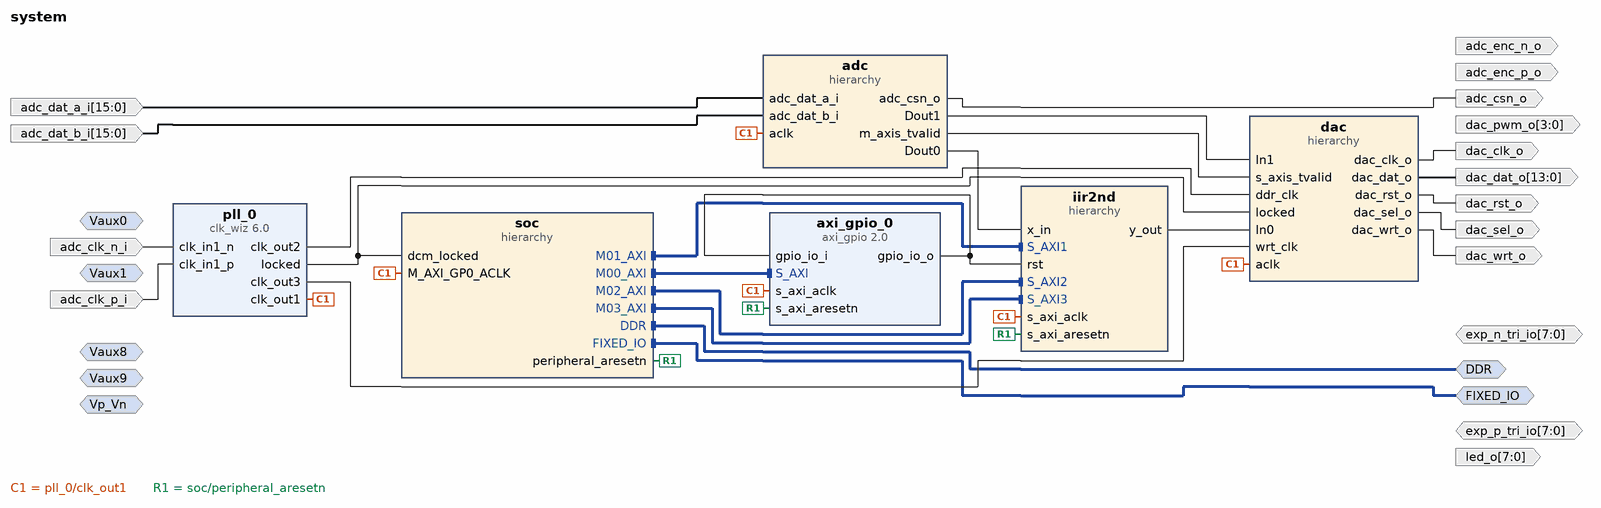
[diagram p0: block diagram of the top level]
# Vivado block design system, xc7z010clg400-1, Vivado 2024.1
create_bd_design system

create_bd_intf_port -mode Slave -vlnv xilinx.com:interface:diff_analog_io_rtl:1.0 Vp_Vn
create_bd_intf_port -mode Slave -vlnv xilinx.com:interface:diff_analog_io_rtl:1.0 Vaux0
create_bd_intf_port -mode Slave -vlnv xilinx.com:interface:diff_analog_io_rtl:1.0 Vaux1
create_bd_intf_port -mode Slave -vlnv xilinx.com:interface:diff_analog_io_rtl:1.0 Vaux9
create_bd_intf_port -mode Slave -vlnv xilinx.com:interface:diff_analog_io_rtl:1.0 Vaux8
create_bd_intf_port -mode Master -vlnv xilinx.com:interface:ddrx_rtl:1.0 DDR
create_bd_intf_port -mode Master -vlnv xilinx.com:display_processing_system7:fixedio_rtl:1.0 FIXED_IO
create_bd_port -dir I -from 15 -to 0 adc_dat_a_i
create_bd_port -dir I -from 15 -to 0 adc_dat_b_i
create_bd_port -dir I adc_clk_p_i
create_bd_port -dir I adc_clk_n_i
create_bd_port -dir O adc_enc_p_o
create_bd_port -dir O adc_enc_n_o
create_bd_port -dir O adc_csn_o
create_bd_port -dir O -from 13 -to 0 dac_dat_o
create_bd_port -dir O dac_clk_o
create_bd_port -dir O dac_rst_o
create_bd_port -dir O dac_sel_o
create_bd_port -dir O dac_wrt_o
create_bd_port -dir O -from 3 -to 0 dac_pwm_o
create_bd_port -dir IO -from 7 -to 0 exp_p_tri_io
create_bd_port -dir IO -from 7 -to 0 exp_n_tri_io
create_bd_port -dir O -from 7 -to 0 led_o

create_bd_cell -type ip -vlnv xilinx.com:ip:clk_wiz:6.0 pll_0
set_property -dict [list \
  CONFIG.CLKIN1_JITTER_PS 80.0 \
  CONFIG.CLKOUT1_DRIVES BUFG \
  CONFIG.CLKOUT1_JITTER 119.348 \
  CONFIG.CLKOUT1_PHASE_ERROR 96.948 \
  CONFIG.CLKOUT1_REQUESTED_OUT_FREQ 125.0 \
  CONFIG.CLKOUT1_USED true \
  CONFIG.CLKOUT2_DRIVES BUFG \
  CONFIG.CLKOUT2_JITTER 104.759 \
  CONFIG.CLKOUT2_PHASE_ERROR 96.948 \
  CONFIG.CLKOUT2_REQUESTED_OUT_FREQ 250.0 \
  CONFIG.CLKOUT2_REQUESTED_PHASE 157.5 \
  CONFIG.CLKOUT2_USED true \
  CONFIG.CLKOUT3_DRIVES BUFG \
  CONFIG.CLKOUT3_JITTER 104.759 \
  CONFIG.CLKOUT3_PHASE_ERROR 96.948 \
  CONFIG.CLKOUT3_REQUESTED_OUT_FREQ 250.0 \
  CONFIG.CLKOUT3_REQUESTED_PHASE 202.5 \
  CONFIG.CLKOUT3_USED true \
  CONFIG.CLKOUT4_DRIVES BUFG \
  CONFIG.CLKOUT4_JITTER 158.331 \
  CONFIG.CLKOUT4_PHASE_ERROR 96.948 \
  CONFIG.CLKOUT4_USED true \
  CONFIG.CLKOUT5_DRIVES BUFG \
  CONFIG.CLKOUT6_DRIVES BUFG \
  CONFIG.CLKOUT7_DRIVES BUFG \
  CONFIG.CLK_OUT1_PORT clk_out1 \
  CONFIG.CLK_OUT4_PORT clk_out4 \
  CONFIG.MMCM_CLKFBOUT_MULT_F 8 \
  CONFIG.MMCM_CLKIN1_PERIOD 8.000 \
  CONFIG.MMCM_CLKIN2_PERIOD 10.0 \
  CONFIG.MMCM_CLKOUT0_DIVIDE_F 8 \
  CONFIG.MMCM_CLKOUT1_DIVIDE 4 \
  CONFIG.MMCM_CLKOUT1_PHASE 157.500 \
  CONFIG.MMCM_CLKOUT2_DIVIDE 4 \
  CONFIG.MMCM_CLKOUT2_PHASE 202.500 \
  CONFIG.MMCM_CLKOUT3_DIVIDE 32 \
  CONFIG.NUM_OUT_CLKS 4 \
  CONFIG.PLL_CLKIN_PERIOD 8.000 \
  CONFIG.PRIMITIVE PLL \
  CONFIG.PRIM_IN_FREQ 125.0 \
  CONFIG.PRIM_SOURCE Differential_clock_capable_pin \
  CONFIG.SECONDARY_SOURCE Single_ended_clock_capable_pin \
  CONFIG.USE_PHASE_ALIGNMENT true \
  CONFIG.USE_RESET false \
] [get_bd_cells pll_0]
create_bd_cell -type hier soc
create_bd_cell -type hier iir2nd
create_bd_cell -type hier dac
create_bd_cell -type hier adc
create_bd_cell -type ip -vlnv xilinx.com:ip:axi_gpio:2.0 axi_gpio_0
set_property -dict [list \
  CONFIG.C_ALL_INPUTS 0 \
  CONFIG.C_ALL_OUTPUTS 0 \
  CONFIG.C_GPIO_WIDTH 1 \
  CONFIG.C_IS_DUAL 0 \
] [get_bd_cells axi_gpio_0]

# ---- hierarchy /soc ----
current_bd_instance /soc
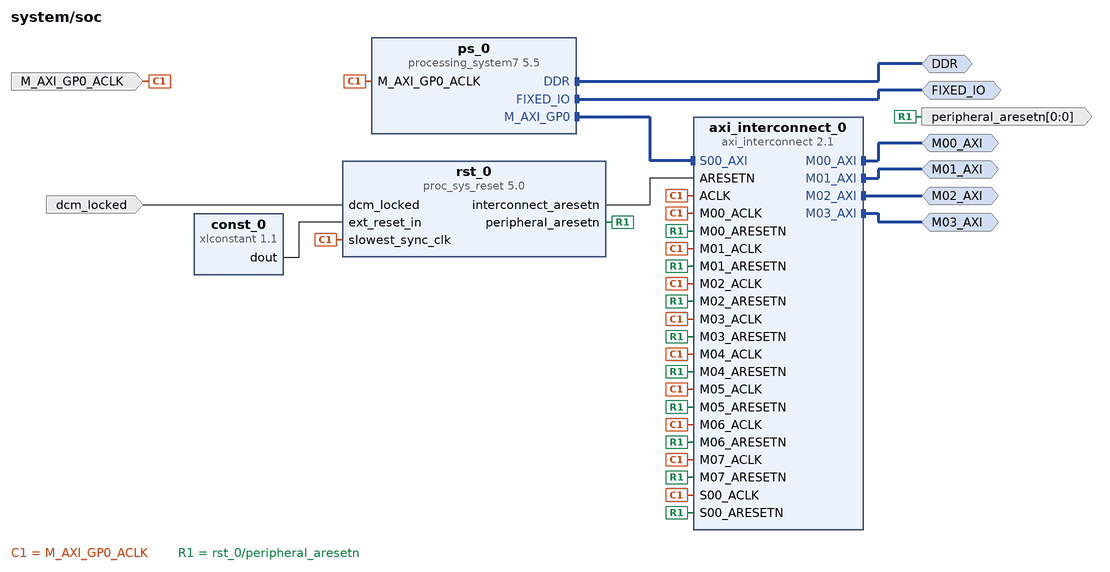
[diagram p1: block diagram inside /soc]
create_bd_intf_pin -mode Master -vlnv xilinx.com:interface:ddrx_rtl:1.0 DDR
create_bd_intf_pin -mode Master -vlnv xilinx.com:display_processing_system7:fixedio_rtl:1.0 FIXED_IO
create_bd_intf_pin -mode Master -vlnv xilinx.com:interface:aximm_rtl:1.0 M00_AXI
create_bd_intf_pin -mode Master -vlnv xilinx.com:interface:aximm_rtl:1.0 M01_AXI
create_bd_intf_pin -mode Master -vlnv xilinx.com:interface:aximm_rtl:1.0 M02_AXI
create_bd_intf_pin -mode Master -vlnv xilinx.com:interface:aximm_rtl:1.0 M03_AXI
create_bd_pin -dir I -type clk M_AXI_GP0_ACLK
create_bd_pin -dir I dcm_locked
create_bd_pin -dir O -from 0 -to 0 -type rst peripheral_aresetn

create_bd_cell -type ip -vlnv xilinx.com:ip:processing_system7:5.5 ps_0
set_property -dict [list \
  CONFIG.PCW_APU_PERIPHERAL_FREQMHZ 666.666666 \
  CONFIG.PCW_ENET0_ENET0_IO {MIO 16 .. 27} \
  CONFIG.PCW_ENET0_GRP_MDIO_ENABLE 1 \
  CONFIG.PCW_ENET0_GRP_MDIO_IO {MIO 52 .. 53} \
  CONFIG.PCW_ENET0_PERIPHERAL_ENABLE 1 \
  CONFIG.PCW_ENET0_RESET_ENABLE 0 \
  CONFIG.PCW_ENET_RESET_ENABLE 1 \
  CONFIG.PCW_ENET_RESET_SELECT {Share reset pin} \
  CONFIG.PCW_FPGA0_PERIPHERAL_FREQMHZ 50 \
  CONFIG.PCW_FPGA1_PERIPHERAL_FREQMHZ 50 \
  CONFIG.PCW_GPIO_EMIO_GPIO_ENABLE 1 \
  CONFIG.PCW_GPIO_EMIO_GPIO_IO 64 \
  CONFIG.PCW_GPIO_MIO_GPIO_ENABLE 1 \
  CONFIG.PCW_GPIO_MIO_GPIO_IO MIO \
  CONFIG.PCW_GPIO_PERIPHERAL_ENABLE 1 \
  CONFIG.PCW_I2C0_GRP_INT_ENABLE 0 \
  CONFIG.PCW_I2C0_I2C0_IO {MIO 50 .. 51} \
  CONFIG.PCW_I2C0_PERIPHERAL_ENABLE 1 \
  CONFIG.PCW_I2C_PERIPHERAL_FREQMHZ 111.111115 \
  CONFIG.PCW_I2C_RESET_ENABLE 1 \
  CONFIG.PCW_I2C_RESET_SELECT {Share reset pin} \
  CONFIG.PCW_IMPORT_BOARD_PRESET cfg/red_pitaya.xml \
  CONFIG.PCW_PRESET_BANK1_VOLTAGE {LVCMOS 2.5V} \
  CONFIG.PCW_QSPI_PERIPHERAL_ENABLE 0 \
  CONFIG.PCW_SD0_GRP_CD_ENABLE 1 \
  CONFIG.PCW_SD0_GRP_CD_IO {MIO 46} \
  CONFIG.PCW_SD0_GRP_WP_ENABLE 1 \
  CONFIG.PCW_SD0_GRP_WP_IO {MIO 47} \
  CONFIG.PCW_SD0_PERIPHERAL_ENABLE 1 \
  CONFIG.PCW_SD0_SD0_IO {MIO 40 .. 45} \
  CONFIG.PCW_SDIO_PERIPHERAL_FREQMHZ 100 \
  CONFIG.PCW_SPI0_PERIPHERAL_ENABLE 1 \
  CONFIG.PCW_SPI0_SPI0_IO EMIO \
  CONFIG.PCW_SPI1_PERIPHERAL_ENABLE 1 \
  CONFIG.PCW_SPI1_SPI1_IO {MIO 10 .. 15} \
  CONFIG.PCW_UART0_PERIPHERAL_ENABLE 1 \
  CONFIG.PCW_UART0_UART0_IO {MIO 14 .. 15} \
  CONFIG.PCW_UART1_PERIPHERAL_ENABLE 1 \
  CONFIG.PCW_UART1_UART1_IO {MIO 8 .. 9} \
  CONFIG.PCW_UART_PERIPHERAL_FREQMHZ 100 \
  CONFIG.PCW_UIPARAM_DDR_BUS_WIDTH {16 Bit} \
  CONFIG.PCW_UIPARAM_DDR_FREQ_MHZ 533.333333 \
  CONFIG.PCW_UIPARAM_DDR_PARTNO {MT41J256M16 RE-125} \
  CONFIG.PCW_USB0_PERIPHERAL_ENABLE 1 \
  CONFIG.PCW_USB0_RESET_ENABLE 1 \
  CONFIG.PCW_USB0_RESET_IO {MIO 48} \
  CONFIG.PCW_USB0_USB0_IO {MIO 28 .. 39} \
  CONFIG.PCW_USB_RESET_ENABLE 1 \
  CONFIG.PCW_USB_RESET_SELECT {Share reset pin} \
] [get_bd_cells ps_0]
# 429 more settings of ps_0 are not shown: defaults, MIO pin electricals, DDR timing, and values the tool derives
create_bd_cell -type ip -vlnv xilinx.com:ip:proc_sys_reset:5.0 rst_0
create_bd_cell -type ip -vlnv xilinx.com:ip:axi_interconnect:2.1 axi_interconnect_0
set_property -dict {CONFIG.NUM_MI 8} [get_bd_cells axi_interconnect_0]
create_bd_cell -type ip -vlnv xilinx.com:ip:xlconstant:1.1 const_0

# ---- hierarchy /iir2nd ----
current_bd_instance /iir2nd
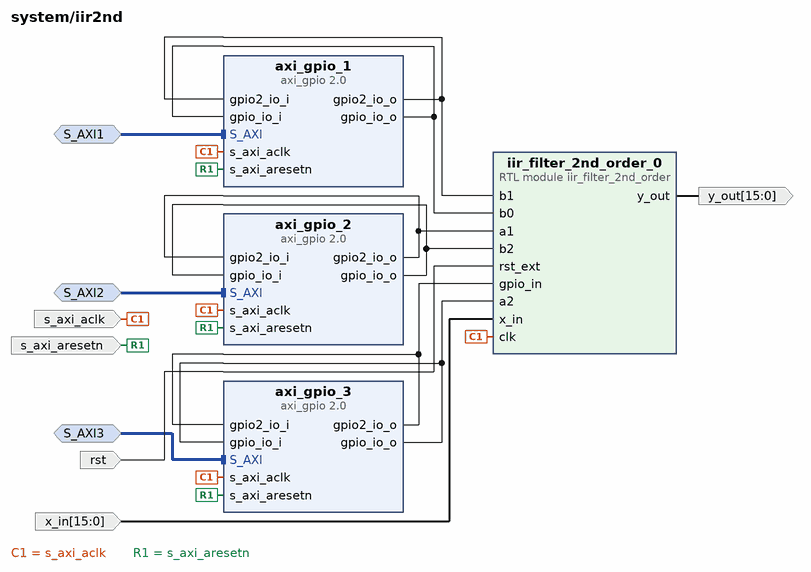
[diagram p2: block diagram inside /iir2nd]
create_bd_intf_pin -mode Slave -vlnv xilinx.com:interface:aximm_rtl:1.0 S_AXI1
create_bd_intf_pin -mode Slave -vlnv xilinx.com:interface:aximm_rtl:1.0 S_AXI2
create_bd_intf_pin -mode Slave -vlnv xilinx.com:interface:aximm_rtl:1.0 S_AXI3
create_bd_pin -dir I -type rst s_axi_aresetn
create_bd_pin -dir I -type clk s_axi_aclk
create_bd_pin -dir I -from 15 -to 0 x_in
create_bd_pin -dir O -from 15 -to 0 y_out
create_bd_pin -dir I -type rst rst

create_bd_cell -type ip -vlnv xilinx.com:ip:axi_gpio:2.0 axi_gpio_1
set_property -dict {CONFIG.C_IS_DUAL 1} [get_bd_cells axi_gpio_1]
create_bd_cell -type ip -vlnv xilinx.com:ip:axi_gpio:2.0 axi_gpio_2
set_property -dict {CONFIG.C_IS_DUAL 1} [get_bd_cells axi_gpio_2]
create_bd_cell -type ip -vlnv xilinx.com:ip:axi_gpio:2.0 axi_gpio_3
set_property -dict {CONFIG.C_IS_DUAL 1} [get_bd_cells axi_gpio_3]
create_bd_cell -type module -reference iir_filter_2nd_order iir_filter_2nd_order_0
set_property -dict [list \
  CONFIG.COEFF_WIDTH 32 \
  CONFIG.DATA_WIDTH 32 \
  CONFIG.IN_DATA_WIDTH 16 \
  CONFIG.LOG_DIV 10 \
] [get_bd_cells iir_filter_2nd_order_0]

# ---- hierarchy /dac ----
current_bd_instance /dac
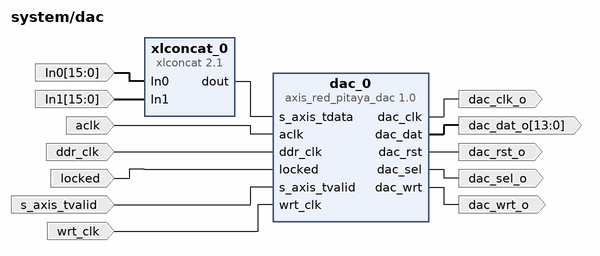
[diagram p3: block diagram inside /dac]
create_bd_pin -dir I s_axis_tvalid
create_bd_pin -dir O -from 13 -to 0 dac_dat_o
create_bd_pin -dir O -type clk dac_clk_o
create_bd_pin -dir O -type rst dac_rst_o
create_bd_pin -dir O dac_wrt_o
create_bd_pin -dir O dac_sel_o
create_bd_pin -dir I locked
create_bd_pin -dir I -type clk wrt_clk
create_bd_pin -dir I -type clk aclk
create_bd_pin -dir I -type clk ddr_clk
create_bd_pin -dir I -from 15 -to 0 In1
create_bd_pin -dir I -from 15 -to 0 In0

create_bd_cell -type ip -vlnv pavel-demin:user:axis_red_pitaya_dac:1.0 dac_0
set_property -dict {CONFIG.DAC_DATA_WIDTH 14} [get_bd_cells dac_0]
create_bd_cell -type ip -vlnv xilinx.com:ip:xlconcat:2.1 xlconcat_0
set_property -dict {CONFIG.IN0_WIDTH 16 CONFIG.IN1_WIDTH 16} [get_bd_cells xlconcat_0]

# ---- hierarchy /adc ----
current_bd_instance /adc
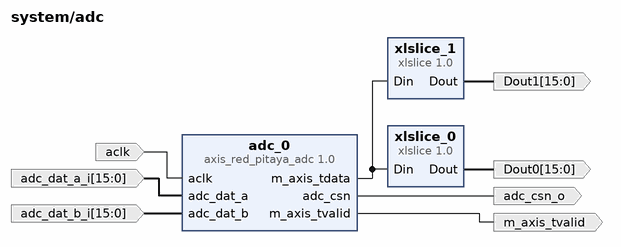
[diagram p4: block diagram inside /adc]
create_bd_pin -dir I -from 15 -to 0 adc_dat_a_i
create_bd_pin -dir I -from 15 -to 0 adc_dat_b_i
create_bd_pin -dir O adc_csn_o
create_bd_pin -dir I -type clk aclk
create_bd_pin -dir O m_axis_tvalid
create_bd_pin -dir O -from 15 -to 0 Dout0
create_bd_pin -dir O -from 15 -to 0 Dout1

create_bd_cell -type ip -vlnv pavel-demin:user:axis_red_pitaya_adc:1.0 adc_0
set_property -dict {CONFIG.ADC_DATA_WIDTH 14} [get_bd_cells adc_0]
create_bd_cell -type ip -vlnv xilinx.com:ip:xlslice:1.0 xlslice_0
set_property -dict {CONFIG.DIN_FROM 15 CONFIG.DIN_TO 0} [get_bd_cells xlslice_0]
create_bd_cell -type ip -vlnv xilinx.com:ip:xlslice:1.0 xlslice_1
set_property -dict {CONFIG.DIN_FROM 31 CONFIG.DIN_TO 16} [get_bd_cells xlslice_1]

# ---- connections ----

current_bd_instance /soc
connect_bd_intf_net [get_bd_intf_pins ps_0/DDR] [get_bd_intf_pins DDR]
connect_bd_intf_net [get_bd_intf_pins ps_0/FIXED_IO] [get_bd_intf_pins FIXED_IO]
connect_bd_intf_net [get_bd_intf_pins axi_interconnect_0/M03_AXI] [get_bd_intf_pins M03_AXI]
connect_bd_intf_net [get_bd_intf_pins M00_AXI] [get_bd_intf_pins axi_interconnect_0/M00_AXI]
connect_bd_intf_net [get_bd_intf_pins M01_AXI] [get_bd_intf_pins axi_interconnect_0/M01_AXI]
connect_bd_intf_net [get_bd_intf_pins M02_AXI] [get_bd_intf_pins axi_interconnect_0/M02_AXI]
connect_bd_intf_net [get_bd_intf_pins ps_0/M_AXI_GP0] [get_bd_intf_pins axi_interconnect_0/S00_AXI]
connect_bd_net [get_bd_pins M_AXI_GP0_ACLK] \
  [get_bd_pins ps_0/M_AXI_GP0_ACLK] [get_bd_pins rst_0/slowest_sync_clk] [get_bd_pins axi_interconnect_0/M07_ACLK] \
  [get_bd_pins axi_interconnect_0/M06_ACLK] [get_bd_pins axi_interconnect_0/M05_ACLK] \
  [get_bd_pins axi_interconnect_0/M04_ACLK] [get_bd_pins axi_interconnect_0/M03_ACLK] \
  [get_bd_pins axi_interconnect_0/M02_ACLK] [get_bd_pins axi_interconnect_0/M01_ACLK] \
  [get_bd_pins axi_interconnect_0/M00_ACLK] [get_bd_pins axi_interconnect_0/S00_ACLK] [get_bd_pins axi_interconnect_0/ACLK]
connect_bd_net [get_bd_pins const_0/dout] [get_bd_pins rst_0/ext_reset_in]
connect_bd_net [get_bd_pins dcm_locked] [get_bd_pins rst_0/dcm_locked]
connect_bd_net [get_bd_pins rst_0/interconnect_aresetn] [get_bd_pins axi_interconnect_0/ARESETN]
connect_bd_net [get_bd_pins rst_0/peripheral_aresetn] \
  [get_bd_pins axi_interconnect_0/M06_ARESETN] [get_bd_pins axi_interconnect_0/M05_ARESETN] \
  [get_bd_pins axi_interconnect_0/M04_ARESETN] [get_bd_pins axi_interconnect_0/M03_ARESETN] \
  [get_bd_pins axi_interconnect_0/M02_ARESETN] [get_bd_pins axi_interconnect_0/M01_ARESETN] \
  [get_bd_pins axi_interconnect_0/M00_ARESETN] [get_bd_pins axi_interconnect_0/S00_ARESETN] [get_bd_pins peripheral_aresetn] \
  [get_bd_pins axi_interconnect_0/M07_ARESETN]

current_bd_instance /iir2nd
connect_bd_intf_net -intf_net S_AXI1_1 [get_bd_intf_pins S_AXI2] [get_bd_intf_pins axi_gpio_2/S_AXI]
connect_bd_intf_net -intf_net S_AXI3_1 [get_bd_intf_pins S_AXI3] [get_bd_intf_pins axi_gpio_3/S_AXI]
connect_bd_intf_net [get_bd_intf_pins S_AXI1] [get_bd_intf_pins axi_gpio_1/S_AXI]
connect_bd_net -net axi_gpio_0_gpio2_io_o [get_bd_pins axi_gpio_1/gpio2_io_o] \
  [get_bd_pins axi_gpio_1/gpio2_io_i] [get_bd_pins iir_filter_2nd_order_0/b1]
connect_bd_net -net axi_gpio_0_gpio_io_o [get_bd_pins axi_gpio_1/gpio_io_o] [get_bd_pins axi_gpio_1/gpio_io_i] [get_bd_pins iir_filter_2nd_order_0/b0]
connect_bd_net -net axi_gpio_1_gpio2_io_o [get_bd_pins axi_gpio_2/gpio2_io_o] \
  [get_bd_pins axi_gpio_2/gpio2_io_i] [get_bd_pins iir_filter_2nd_order_0/a1]
connect_bd_net -net axi_gpio_1_gpio_io_o [get_bd_pins axi_gpio_2/gpio_io_o] [get_bd_pins axi_gpio_2/gpio_io_i] [get_bd_pins iir_filter_2nd_order_0/b2]
connect_bd_net -net axi_gpio_2_gpio2_io_o [get_bd_pins axi_gpio_3/gpio2_io_o] \
  [get_bd_pins axi_gpio_3/gpio2_io_i] [get_bd_pins iir_filter_2nd_order_0/gpio_in]
connect_bd_net -net axi_gpio_2_gpio_io_o [get_bd_pins axi_gpio_3/gpio_io_o] [get_bd_pins axi_gpio_3/gpio_io_i] [get_bd_pins iir_filter_2nd_order_0/a2]
connect_bd_net [get_bd_pins iir_filter_2nd_order_0/y_out] [get_bd_pins y_out]
connect_bd_net [get_bd_pins rst] [get_bd_pins iir_filter_2nd_order_0/rst_ext]
connect_bd_net [get_bd_pins s_axi_aclk] \
  [get_bd_pins axi_gpio_1/s_axi_aclk] [get_bd_pins axi_gpio_2/s_axi_aclk] [get_bd_pins axi_gpio_3/s_axi_aclk] \
  [get_bd_pins iir_filter_2nd_order_0/clk]
connect_bd_net [get_bd_pins s_axi_aresetn] \
  [get_bd_pins axi_gpio_3/s_axi_aresetn] [get_bd_pins axi_gpio_2/s_axi_aresetn] [get_bd_pins axi_gpio_1/s_axi_aresetn]
connect_bd_net [get_bd_pins x_in] [get_bd_pins iir_filter_2nd_order_0/x_in]

current_bd_instance /dac
connect_bd_net -net In0_1 [get_bd_pins In0] [get_bd_pins xlconcat_0/In0]
connect_bd_net -net In1_1 [get_bd_pins In1] [get_bd_pins xlconcat_0/In1]
connect_bd_net [get_bd_pins aclk] [get_bd_pins dac_0/aclk]
connect_bd_net [get_bd_pins dac_0/dac_clk] [get_bd_pins dac_clk_o]
connect_bd_net [get_bd_pins dac_0/dac_dat] [get_bd_pins dac_dat_o]
connect_bd_net [get_bd_pins dac_0/dac_rst] [get_bd_pins dac_rst_o]
connect_bd_net [get_bd_pins dac_0/dac_sel] [get_bd_pins dac_sel_o]
connect_bd_net [get_bd_pins dac_0/dac_wrt] [get_bd_pins dac_wrt_o]
connect_bd_net [get_bd_pins ddr_clk] [get_bd_pins dac_0/ddr_clk]
connect_bd_net [get_bd_pins locked] [get_bd_pins dac_0/locked]
connect_bd_net [get_bd_pins s_axis_tvalid] [get_bd_pins dac_0/s_axis_tvalid]
connect_bd_net [get_bd_pins wrt_clk] [get_bd_pins dac_0/wrt_clk]
connect_bd_net [get_bd_pins xlconcat_0/dout] [get_bd_pins dac_0/s_axis_tdata]

current_bd_instance /adc
connect_bd_net [get_bd_pins aclk] [get_bd_pins adc_0/aclk]
connect_bd_net [get_bd_pins adc_0/adc_csn] [get_bd_pins adc_csn_o]
connect_bd_net [get_bd_pins adc_0/m_axis_tdata] [get_bd_pins xlslice_0/Din] [get_bd_pins xlslice_1/Din]
connect_bd_net [get_bd_pins adc_0/m_axis_tvalid] [get_bd_pins m_axis_tvalid]
connect_bd_net [get_bd_pins adc_dat_a_i] [get_bd_pins adc_0/adc_dat_a]
connect_bd_net [get_bd_pins adc_dat_b_i] [get_bd_pins adc_0/adc_dat_b]
connect_bd_net [get_bd_pins xlslice_0/Dout] [get_bd_pins Dout0]
connect_bd_net [get_bd_pins xlslice_1/Dout] [get_bd_pins Dout1]

current_bd_instance /
connect_bd_intf_net [get_bd_intf_ports DDR] [get_bd_intf_pins soc/DDR]
connect_bd_intf_net [get_bd_intf_ports FIXED_IO] [get_bd_intf_pins soc/FIXED_IO]
connect_bd_intf_net [get_bd_intf_pins soc/M00_AXI] [get_bd_intf_pins axi_gpio_0/S_AXI]
connect_bd_intf_net [get_bd_intf_pins soc/M01_AXI] [get_bd_intf_pins iir2nd/S_AXI1]
connect_bd_intf_net [get_bd_intf_pins soc/M02_AXI] [get_bd_intf_pins iir2nd/S_AXI2]
connect_bd_intf_net [get_bd_intf_pins soc/M03_AXI] [get_bd_intf_pins iir2nd/S_AXI3]
connect_bd_net [get_bd_pins adc/Dout1] [get_bd_pins dac/In1]
connect_bd_net [get_bd_pins adc/adc_csn_o] [get_bd_ports adc_csn_o]
connect_bd_net [get_bd_ports adc_clk_n_i] [get_bd_pins pll_0/clk_in1_n]
connect_bd_net [get_bd_ports adc_clk_p_i] [get_bd_pins pll_0/clk_in1_p]
connect_bd_net [get_bd_ports adc_dat_a_i] [get_bd_pins adc/adc_dat_a_i]
connect_bd_net [get_bd_ports adc_dat_b_i] [get_bd_pins adc/adc_dat_b_i]
connect_bd_net [get_bd_pins adc/m_axis_tvalid] [get_bd_pins dac/s_axis_tvalid]
connect_bd_net [get_bd_pins axi_gpio_0/gpio_io_o] [get_bd_pins iir2nd/rst] [get_bd_pins axi_gpio_0/gpio_io_i]
connect_bd_net [get_bd_pins dac/dac_clk_o] [get_bd_ports dac_clk_o]
connect_bd_net [get_bd_pins dac/dac_dat_o] [get_bd_ports dac_dat_o]
connect_bd_net [get_bd_pins dac/dac_rst_o] [get_bd_ports dac_rst_o]
connect_bd_net [get_bd_pins dac/dac_sel_o] [get_bd_ports dac_sel_o]
connect_bd_net [get_bd_pins dac/dac_wrt_o] [get_bd_ports dac_wrt_o]
connect_bd_net [get_bd_pins iir2nd/y_out] [get_bd_pins dac/In0]
connect_bd_net -net pll_0_clk_out1_125 [get_bd_pins pll_0/clk_out1] \
  [get_bd_pins adc/aclk] [get_bd_pins soc/M_AXI_GP0_ACLK] [get_bd_pins iir2nd/s_axi_aclk] [get_bd_pins dac/aclk] \
  [get_bd_pins axi_gpio_0/s_axi_aclk]
connect_bd_net [get_bd_pins pll_0/clk_out2] [get_bd_pins dac/ddr_clk]
connect_bd_net [get_bd_pins pll_0/clk_out3] [get_bd_pins dac/wrt_clk]
connect_bd_net [get_bd_pins pll_0/locked] [get_bd_pins soc/dcm_locked] [get_bd_pins dac/locked]
connect_bd_net -net s_axi_aresetn_1 [get_bd_pins soc/peripheral_aresetn] [get_bd_pins iir2nd/s_axi_aresetn] [get_bd_pins axi_gpio_0/s_axi_aresetn]
connect_bd_net -net x_in_1 [get_bd_pins adc/Dout0] [get_bd_pins iir2nd/x_in]

# ---- address map ----
assign_bd_address -offset 0x41200000 -range 64K -target_address_space [get_bd_addr_spaces soc/ps_0/Data] [get_bd_addr_segs iir2nd/axi_gpio_1/S_AXI/Reg]
assign_bd_address -offset 0x41210000 -range 64K -target_address_space [get_bd_addr_spaces soc/ps_0/Data] [get_bd_addr_segs iir2nd/axi_gpio_2/S_AXI/Reg]
assign_bd_address -offset 0x41220000 -range 64K -target_address_space [get_bd_addr_spaces soc/ps_0/Data] [get_bd_addr_segs iir2nd/axi_gpio_3/S_AXI/Reg]
assign_bd_address -offset 0x41230000 -range 64K -target_address_space [get_bd_addr_spaces soc/ps_0/Data] [get_bd_addr_segs axi_gpio_0/S_AXI/Reg]

validate_bd_design
save_bd_design
